# EAGLE design p-stop_03 (EAGLE 6.5.0)
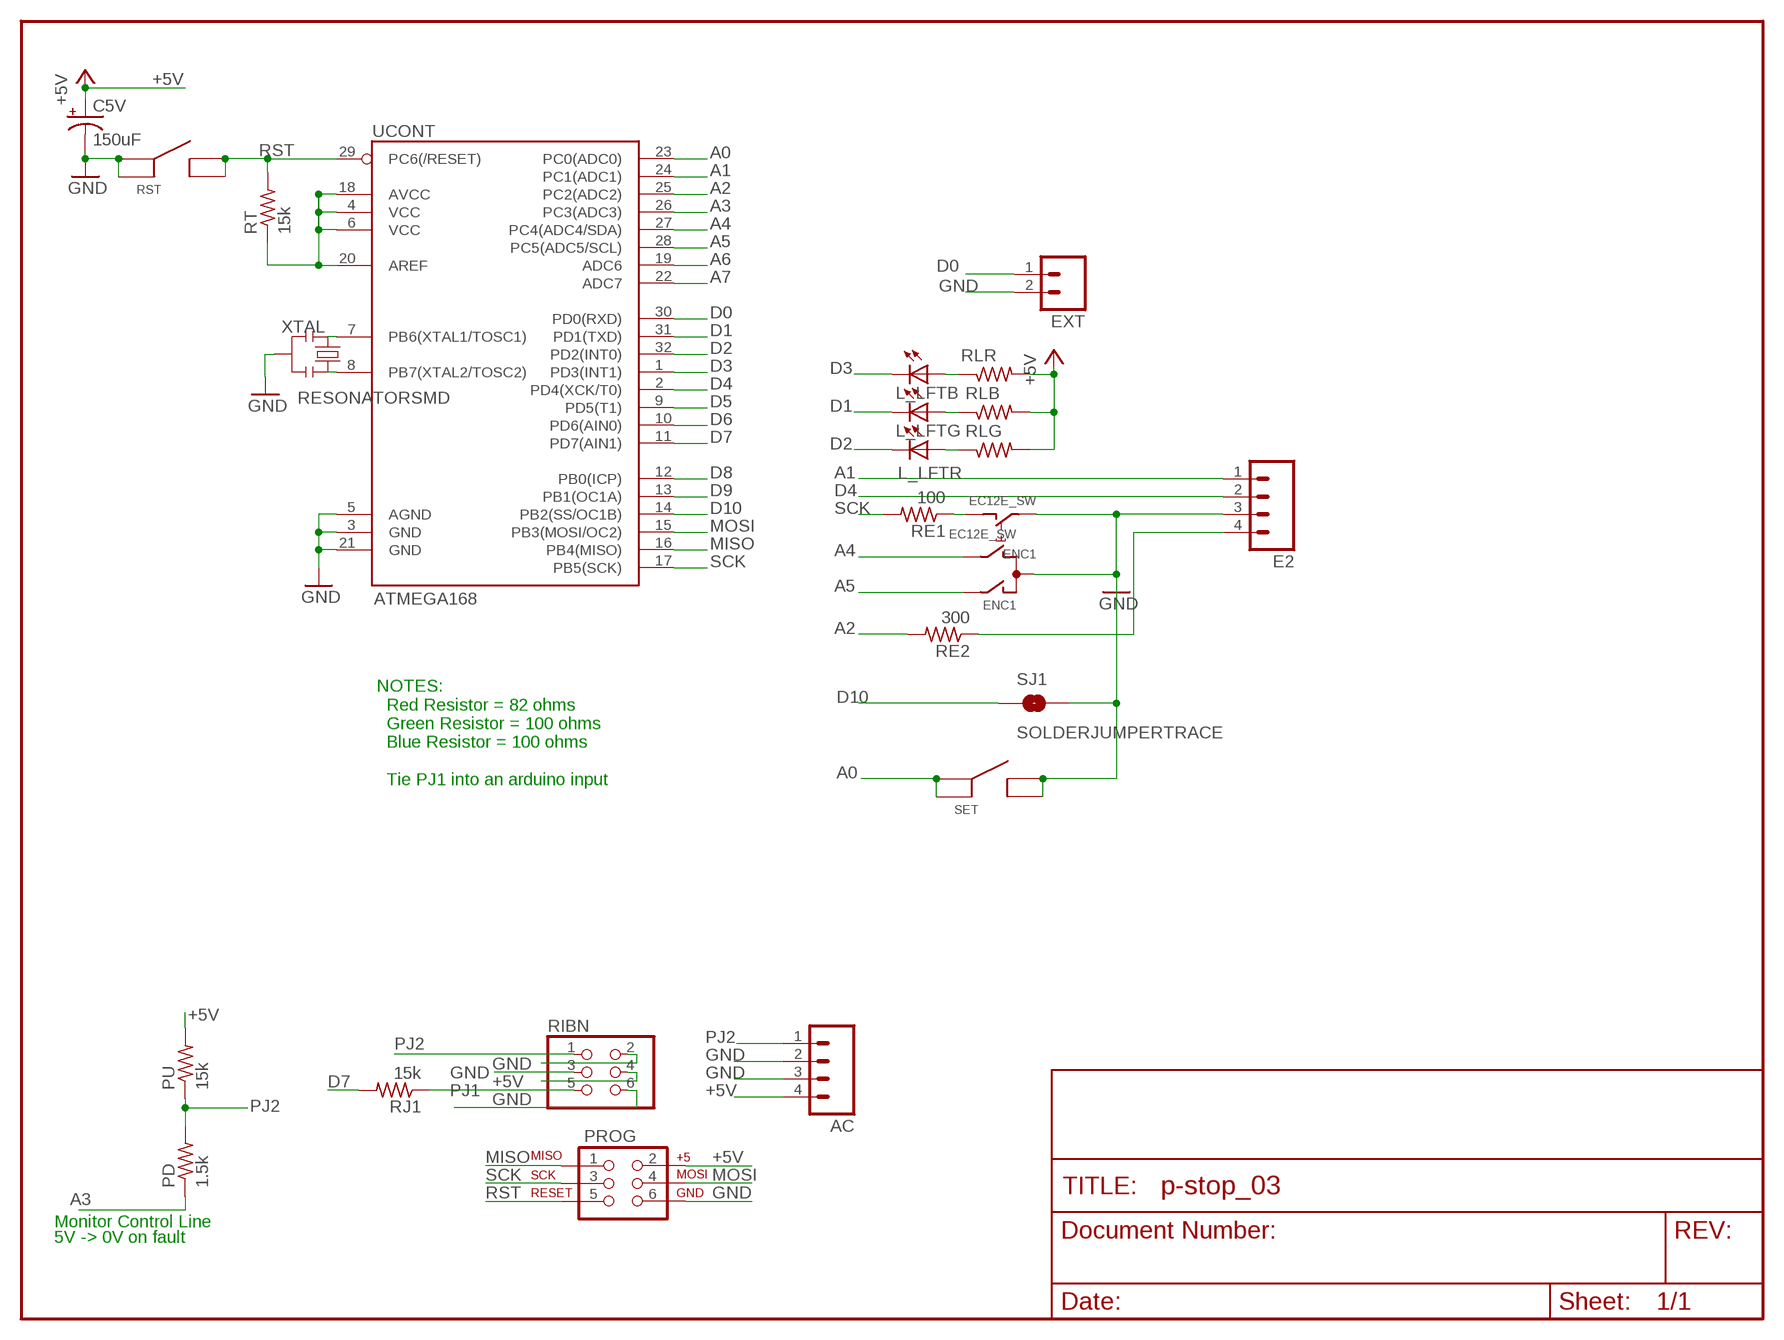
[diagram p0: schematic, sheet 1]

## Parts
AC  M04PTH  [1X04]
C5V  150uF  CAP_POL3528  [EIA3528]
E2  M04PTH  [1X04]
ENC1  EC12E_SW  [ALPS_EC12E_SW]
EXT  M02PTH  [1X02]
L_LFT  GM5WA94310A  [GM5WA94310A]
PD  1.5k  R-US_MELF0204R  [MINI_MELF-0204R]
PROG  AVR_SPI_PRG_6NS  [2X3-NS]
PU  15k  R-US_MELF0204R  [MINI_MELF-0204R]
RE1  100  R-US_MELF0204R  [MINI_MELF-0204R]
RE2  300  R-US_MELF0204R  [MINI_MELF-0204R]
RIBN  PINHD-2X3  [2X03]
RJ1  15k  R-US_MELF0204R  [MINI_MELF-0204R]
RLB  100  R-US_MELF0204R  [MINI_MELF-0204R]
RLG  100  R-US_MELF0204R  [MINI_MELF-0204R]
RLR  100  R-US_MELF0204R  [MINI_MELF-0204R]
RST  6MM_TACT_SMD  [6MMSMDTACT]
RT  15k  R-US_MELF0204R  [MINI_MELF-0204R]
SET  6MM_TACT_SMD  [6MMSMDTACT]
SJ1  SOLDERJUMPERTRACE  [SJ_2S-TRACE]
UCONT  ATMEGA168  [TQFP32-08]
XTAL  RESONATORSMD  [RESONATOR-SMD]

## Nets
+5V [VCC]: AC.4 C5V.A(+) PROG.2 PU.2 RIBN.4 RLB.2 RLG.2 RLR.2 RT.1 UCONT.4(VCC) UCONT.6(VCC) UCONT.18(AVCC) UCONT.20(AREF)
A0: SET.P1 SET.P2 UCONT.23(PC0(ADC0))
A1: E2.1 UCONT.24(PC1(ADC1))
A2: RE2.2 UCONT.25(PC2(ADC2))
A3: PD.1 UCONT.26(PC3(ADC3))
A4: ENC1.B UCONT.27(PC4(ADC4/SDA))
A5: ENC1.A UCONT.28(PC5(ADC5/SCL))
A6: UCONT.19(ADC6)
A7: UCONT.22(ADC7)
D0: EXT.1 UCONT.30(PD0(RXD))
D1: L_LFT.4(G:C) UCONT.31(PD1(TXD))
D2: L_LFT.5(R:C) UCONT.32(PD2(INT0))
D3: L_LFT.6(B:C) UCONT.1(PD3(INT1))
D4: E2.2 UCONT.2(PD4(XCK/T0))
D5: UCONT.9(PD5(T1))
D6: UCONT.10(PD6(AIN0))
D7: RJ1.2 UCONT.11(PD7(AIN1))
D8: UCONT.12(PB0(ICP))
D9: UCONT.13(PB1(OC1A))
D10: SJ1.1 UCONT.14(PB2(SS/OC1B))
ENC2L: E2.4 RE2.1
GND: AC.2 AC.3 C5V.C(-) E2.3 ENC1.C ENC1.E EXT.2 PROG.6 RIBN.2 RIBN.3 RIBN.6 RST.P1 RST.P2 SET.N1 SET.N2 SJ1.2 UCONT.3(GND) UCONT.5(AGND) UCONT.21(GND) XTAL.2
MISO: PROG.1 UCONT.16(PB4(MISO))
MOSI: PROG.4 UCONT.15(PB3(MOSI/OC2))
N$1: UCONT.7(PB6(XTAL1/TOSC1)) XTAL.1
N$3: UCONT.8(PB7(XTAL2/TOSC2)) XTAL.3
N$4: ENC1.D RE1.1
N$5: L_LFT.1(B:A) RLR.1
N$7: L_LFT.3(G:A) RLB.1
N$8: L_LFT.2(R:A) RLG.1
PJ1: RIBN.5 RJ1.1
PJ2: AC.1 PD.2 PU.1 RIBN.1
RST: PROG.5 RST.N1 RST.N2 RT.2 UCONT.29(PC6(/RESET))
SCK: PROG.3 RE1.2 UCONT.17(PB5(SCK))
Unconnected: ENC1.GND1(G) ENC1.GND2(G)

## Notes on the sheet
- NOTES:
    Red Resistor = 82 ohms
    Green Resistor = 100 ohms
    Blue Resistor = 100 ohms
    
    Tie PJ1 into an arduino input
- Monitor Control Line
- 5V -> 0V on fault

## Library data of the parts
AC E2 = SparkFun:M04: Header 4 Standard 4-pin 0.1" header. Use with straight break away headers (SKU : PRT-00116), right angle break away headers (PRT-00553), swiss pins (PRT-00743), machine pins (PRT-00117), and female headers (PRT-00115). Molex polarized connector foot print use with SKU : PRT-08231 with associated crimp pins and housings.
C5V = SparkFun:CAP_POL: Capacitor Polarized These are standard SMD and PTH capacitors. Normally 10uF, 47uF, and 100uF in electrolytic and tantalum varieties. Always verify the external diameter of the through hole cap, it varies with capacity, voltage, and manufacturer. The EIA devices should be standard.
ENC1 = switch-alps:EC12E_SW: ALPS rotary Encoder EC12E series with switch; MPN: EC12E2424407; OC_FARNELL: 1520813; OC_NEWARK: 74M1068
EXT = SparkFun-Connectors:M02: Header 2 Standard 2-pin 0.1" header. Use with straight break away headers (SKU : PRT-00116), right angle break away headers (PRT-00553), swiss pins (PRT-00743), machine pins (PRT-00117), and female headers (PRT-00115). Molex polarized connector foot print use with SKU : PRT-08233 with associated crimp pins and housings.
L_LFT = Tunell:GM5WA94310A: Chip LED RGB Source: http://document.sharpsma.com/files/GM5WA94310A_SS.pdf
PD PU RE1 RE2 RJ1 RLB RLG RLR RT = rcl:R-US_: RESISTOR, American symbol
PROG = SparkFun:AVR_SPI_PRG_6: AVR ISP 6 Pin This is the reduced ISP connector for AVR programming. Common on Arduino. This footprint will take up less PCB space and can be used with a 10-pin to 6-pin adapter such as SKU: BOB-08508
RIBN = pinhead:PINHD-2X3: PIN HEADER
RST SET = Tunell:6MM_TACT_SMD
SJ1 = SparkFun-Passives:SOLDERJUMPER: Solder Jumper Standard SMD solder jumper. Used to automate production. Two varients : Normally Open and Normally Closed are the same, but have different paste layers. NC will have a large amount of paste and should jumper during reflow.
UCONT = SparkFun:ATMEGA168
XTAL = SparkFun:RESONATOR: Resonator Small SMD resonator. This is the itty bitty 10/20MHz resonators with built in caps. CSTCE10M0G55 and CSTCE20M0V53. Footprint has been reviewed closely but hasn't been tested yet.

## Net classes
0 Default: width 0.203 mm
1 VCC: width 0.305 mm

## Board
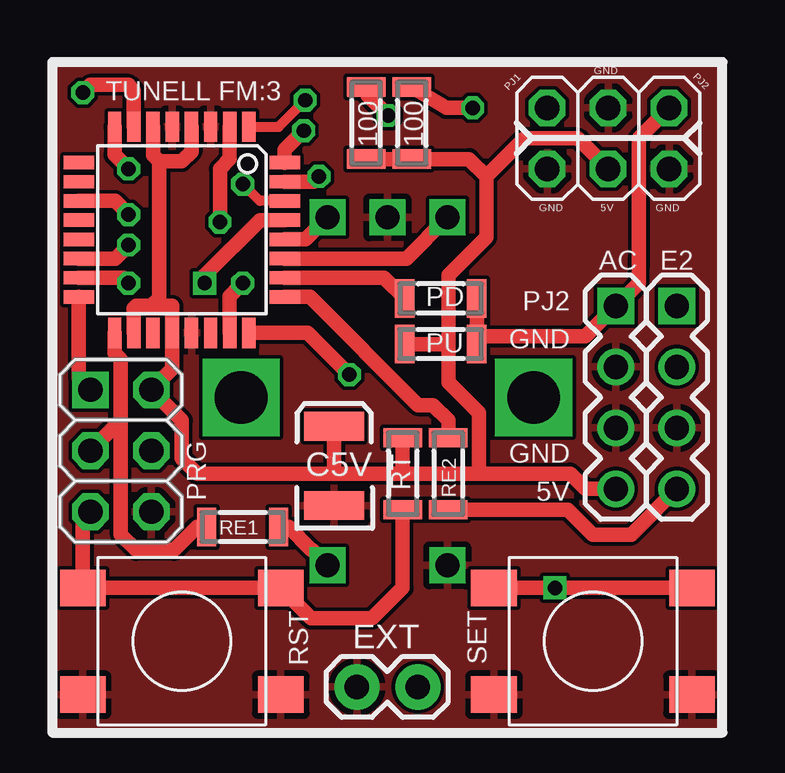
[diagram p1: board, top side]
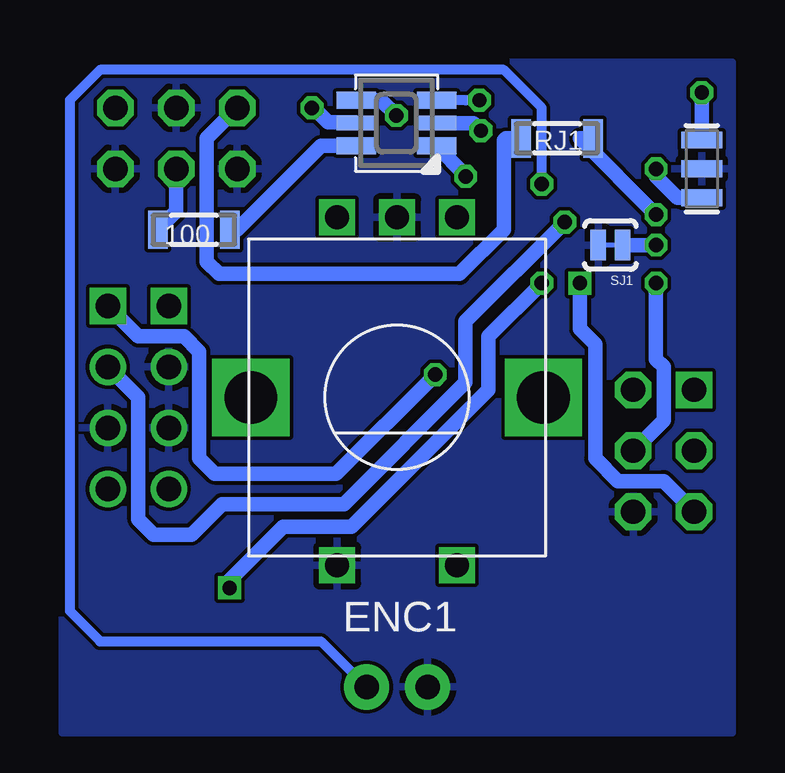
[diagram p2: board, bottom side, seen from below]

No outline drawn. Coordinates in mm, seen from the top.
Copper layers (1*16): Top 0.0356mm / dielectric 1.5011mm / Bottom 0.0356mm
Design rules "LaenPCBOrder": minimum track width 6mil, minimum drill 13mil, track to track 6mil, track to pad 6mil, pad to pad 6mil, via to via 6mil, smd to smd 6mil, copper to edge 15mil, drill to drill 6mil, minimum pad ring 7mil, minimum via ring 7mil, stop-mask expansion 3mil, vias tented up to drill 0mil, thermal gap 10mil

### Footprints (pad centres in the part's own frame; a part is rotated, then mirrored left to right if it is on the bottom)
1X04 = drill 1.016 square: 1 0,0 | drill 1.016: 2 2.54,0; 3 5.08,0; 4 7.62,0
EIA3528 = smd 1.2 x 2.5: A 1.65,0; C -1.65,0
ALPS_EC12E_SW = drill 1 square: A -2.5,-7.5; B 2.5,-7.5; C 0,-7.5; D -2.5,7; E 2.5,7 | drill 2.2 square: GND1 -6.1,0; GND2 6.1,0
1X02 = drill 1.016 pad 1.88: 1 0,0; 2 2.54,0
GM5WA94310A = smd 0.7 x 1.65: 1 -0.95,-1.675; 3 0.95,-1.675; 4 0.95,1.675; 6 -0.95,1.675 | smd 0.6 x 1.65: 2 0,-1.675; 5 0,1.675
MINI_MELF-0204R = smd 0.8 x 1.6: 1 -1.5,0; 2 1.5,0
2X3-NS = drill 1.016 square: 1 -2.54,-1.27 | drill 1.016 octagon: 2 -2.54,1.27; 3 0,-1.27; 4 0,1.27; 5 2.54,-1.27; 6 2.54,1.27
2X03 = drill 1.016 octagon: 1 -2.54,-1.27; 2 -2.54,1.27; 3 0,-1.27; 4 0,1.27; 5 2.54,-1.27; 6 2.54,1.27
6MMSMDTACT = smd 1.905 x 1.524: N1 -4.128,-2.223; N2 4.128,-2.223; P1 -4.128,2.223; P2 4.128,2.223
SJ_2S-TRACE = smd 0.635 x 1.27: 1 -0.508,0; 2 0.508,0
TQFP32-08 = smd 1.27 x 0.559: 1 -4.293,2.8; 2 -4.293,2; 3 -4.293,1.2; 4 -4.293,0.4; 5 -4.293,-0.4; 6 -4.293,-1.2; 7 -4.293,-2; 8 -4.293,-2.8; 17 4.293,-2.8; 18 4.293,-2; 19 4.293,-1.2; 20 4.293,-0.4; 21 4.293,0.4; 22 4.293,1.2; 23 4.293,2; 24 4.293,2.8 | smd 0.559 x 1.27: 9 -2.8,-4.293; 10 -2,-4.293; 11 -1.2,-4.293; 12 -0.4,-4.293; 13 0.4,-4.293; 14 1.2,-4.293; 15 2,-4.293; 16 2.8,-4.293; 25 2.8,4.293; 26 2,4.293; 27 1.2,4.293; 28 0.4,4.293; 29 -0.4,4.293; 30 -1.2,4.293; 31 -2,4.293; 32 -2.8,4.293
RESONATOR-SMD = smd 0.7 x 1.7: 1 -1.2,0; 2 0,0; 3 1.2,0

### Placement (x,y rotation side)
AC  23.5,17.78 270 top
C5V  11.75,11.11 90 top
E2  26.04,17.78 270 top
ENC1  13.97,13.97 180 bottom
EXT  15.24,1.91 180 top
L_LFT  14,25.4 270 bottom
PD  16.19,18.1 0 top
PROG  2.86,11.75 270 top
PU  16.19,16.19 180 top
RE1  7.94,8.57 180 top
RE2  16.51,10.79 90 top
RIBN  23.18,24.77 180 top
RJ1  7.3,24.77 0 bottom
RLB  22.45,20.95 180 bottom
RLG  14.99,25.4 270 top
RLR  13.08,25.4 270 top
RST  5.4,3.81 180 top
RT  14.61,10.79 270 top
SET  22.54,3.81 0 top
SJ1  5.08,20.32 180 bottom
UCONT  5.4,20.95 270 top
XTAL  1.27,23.5 270 bottom

### Tracks (layer width: path | path; a pad name or v marks a point on that pad's centre or on a via)
+5V
  Top 0.61: 14.61,10.79 11.75,10.79 | 11.75,10.79 6.03,10.79 5.4,11.43 5.4,13.02 PROG.2 5,15.16 UCONT.20 5,17.78 4.13,17.78 | RLR.2 RLG.2 17.38,23.9 18.1,23.18 | UCONT.18 3.4,17.68 3.49,17.78 4.13,17.78 | 5.8,24.85 UCONT.4 5.8,24.21 5.4,23.81 4.45,23.81 | 4.45,23.81 4.45,18.1 4.13,17.78 | 18.1,23.18 18.1,20.64 16.51,19.05 16.51,16.19 | 14.61,10.79 17.78,10.79 | 17.78,10.79 21.59,10.79 22.23,10.16 AC.4 | RIBN.4 21.91,24.77 19.68,24.77 18.1,23.18 | 16.51,16.19 16.51,14.61 17.78,13.34 17.78,10.79 | RT.1 14.61,10.79 | C5V.A 11.75,10.79 | PU.2 16.51,16.19 | UCONT.6 4.2,24.06 4.45,23.81
  Bottom 0.61: RIBN.4 23.18,21.73 RLB.2
A0  (via drill 0.6)
  Top 0.61: UCONT.23 7.4,18.19 v7.94,18.73 | v20.95,6.03 SET.P1 SET.P2
  Bottom 0.61: v7.94,18.73 10.16,16.51 10.16,14.29 15.88,8.57 18.73,8.57 20.95,6.35 v20.95,6.03
A1  (via drill 0.6)
  Top 0.61: UCONT.24 10.64,16.66 v12.38,14.92
  Bottom 0.61: E2.1 24.77,16.51 22.86,16.51 22.23,15.88 22.23,11.43 21.59,10.79 16.51,10.79 v12.38,14.92
A2
  Top 0.61: UCONT.25 10.74,18.16 15.24,13.65 15.88,13.65 16.51,13.02 RE2.2 16.28,12.29
A3
  Top 0.61: UCONT.26 13.84,18.95 PD.1
A4
  Top 0.61: ENC1.B 14.76,19.75 UCONT.27
A5
  Top 0.61: UCONT.28 10.55,20.55 ENC1.A
D0  (via drill 0.6)
  Top 0.406: UCONT.30 8.64,22.16 v7.94,22.86
  Bottom 0.406: v7.94,22.86 7.94,26.04 9.53,27.62 26.35,27.62 27.62,26.35 27.62,5.08 26.35,3.81 17.14,3.81 EXT.1
D1  (via drill 0.6)
  Top 0.61: UCONT.31 10.89,22.95 v11.11,23.18
  Bottom 0.61: v11.11,23.18 11.11,23.24 L_LFT.4
D2  (via drill 0.6)
  Top 0.61: UCONT.32 9.69,24.3 v10.48,25.08
  Bottom 0.61: v10.48,25.08 10.79,25.4 L_LFT.5
D3  (via drill 0.6)
  Top 0.406: UCONT.1 9.44,25.25 v10.54,26.35
  Bottom 0.406: v10.54,26.35 11.11,26.35 L_LFT.6
D4  (via drill 0.6)
  Top 0.61: UCONT.2 7.4,23.91 6.99,23.5 v6.99,21.27
  Bottom 0.61: E2.2 24.77,13.97 24.77,8.89 24.13,8.26 22.54,8.26 21.27,9.53 16.19,9.53 11.11,14.61 11.11,17.14 v6.99,21.27
D7  (via drill 0.6)
  Top 0.61: UCONT.11 2.61,22.16 v3.17,21.59
  Bottom 0.61: v3.17,21.59 6.35,24.77 RJ1.2
D10  (via drill 0.6)
  Top 0.61: UCONT.14 2.61,19.75 v3.17,20.32
  Bottom 0.61: v3.17,20.32 SJ1.1
ENC2L
  Top 0.61: E2.4 24.13,8.26 22.54,8.26 21.5,9.29 RE2.1
GND
  pour Bottom: 0,27.94 27.94,27.94 27.94,0 0,0
  pour Top: 0,27.94 27.94,27.94 27.94,0 0,0
MISO
  Top 0.61: UCONT.16 1.1,14.77 PROG.1
MOSI  (via drill 0.6)
  Top 0.61: UCONT.15 2.95,18.95 v3.17,18.73
  Bottom 0.61: v3.17,18.73 3.17,15.56 2.86,15.24 2.86,13.02 PROG.4
N$1  (via drill 0.6)
  Top 0.61: UCONT.7 3.4,26.77 3.17,26.99 1.59,26.99 v1.27,26.67
  Bottom 0.61: v1.27,26.67 XTAL.1
N$3  (via drill 0.6)
  Top 0.61: UCONT.8 2.6,24.07 v3.17,23.5
  Bottom 0.61: v3.17,23.5 3.17,23.18 2.29,22.3 XTAL.3
N$4
  Top 0.61: RE1.1 9.84,8.57 10.79,7.62 10.82,7.62 ENC1.D
N$5  (via drill 0.6)
  Top 0.61: RLR.1 13.14,26.55 v14,25.72
  Bottom 0.61: L_LFT.1 14.63,26.35 v14,25.72
N$7
  Bottom 0.61: L_LFT.3 15.96,24.45 17.14,24.45 20.64,20.95 RLB.1
N$8  (via drill 0.6)
  Top 0.61: RLG.1 16.42,26.04 v17.53,26.04
  Bottom 0.61: L_LFT.2 15.71,25.43 16.86,25.43 17.46,26.04 v17.53,26.04
PJ1
  Bottom 0.61: RIBN.5 21.91,24.77 21.91,19.62 21.4,19.11 11.37,19.11 9.53,20.95 9.53,24.68 9.44,24.77 RJ1.1
PJ2
  Top 0.61: PD.2 PU.1 17.69,16.42 17.78,16.51 22.23,16.51 AC.1 24.45,18.73 24.45,19.37 24.45,19.72 24.45,24.77 RIBN.1
RST  (via drill 0.6)
  Top 0.61: UCONT.29 8.65,21.36 6.35,19.05 v6.35,18.73 | RT.2 14.61,6.03 13.34,4.76 10.79,4.76 RST.N1 RST.N2 1.27,8.89 PROG.5
  Bottom 0.61: v6.35,18.73 6.35,16.83 5.71,16.19 5.71,11.43 4.76,10.48 2.86,10.48 PROG.5
SCK
  Top 0.61: 2.86,13.02 2.86,15.56 2.6,15.82 UCONT.17 | 2.86,13.02 PROG.3 | RE1.2 6.03,8.57 5.08,7.62 3.49,7.62 2.86,8.26 2.86,13.02

### Text on the board
_tsilk: PJ1 | GND | PJ2 | TUNELL FM:3 | GND | 5V | GND | PJ2 | GND | PRG | GND | 5V | RST | SET